# Altium schematic sheet Sunfish_ECU_MotorDriver_RevA.SchDoc
size A3; _PRJ_TITLE: PROJECT TITLE; _SHT_TITLE: Sheet; _REV: A; PageSetup: Record=PageOptions|CenterHorizontal=True|CenterVertical=True|PrintScale=0.71|XCorrection=1.00|YCorrection=1.00|PrintKind=0|BorderSize=5000000|LeftOffset=0|BottomOffset=0|Orientation=2|PaperLength=1000|PaperWidth=1000|Scale=100|PaperSource=258|PrintQuality=600|MediaType=1|DitherType=10|PaperKind=A3 (297x420mm)|PrintScaleMode=1
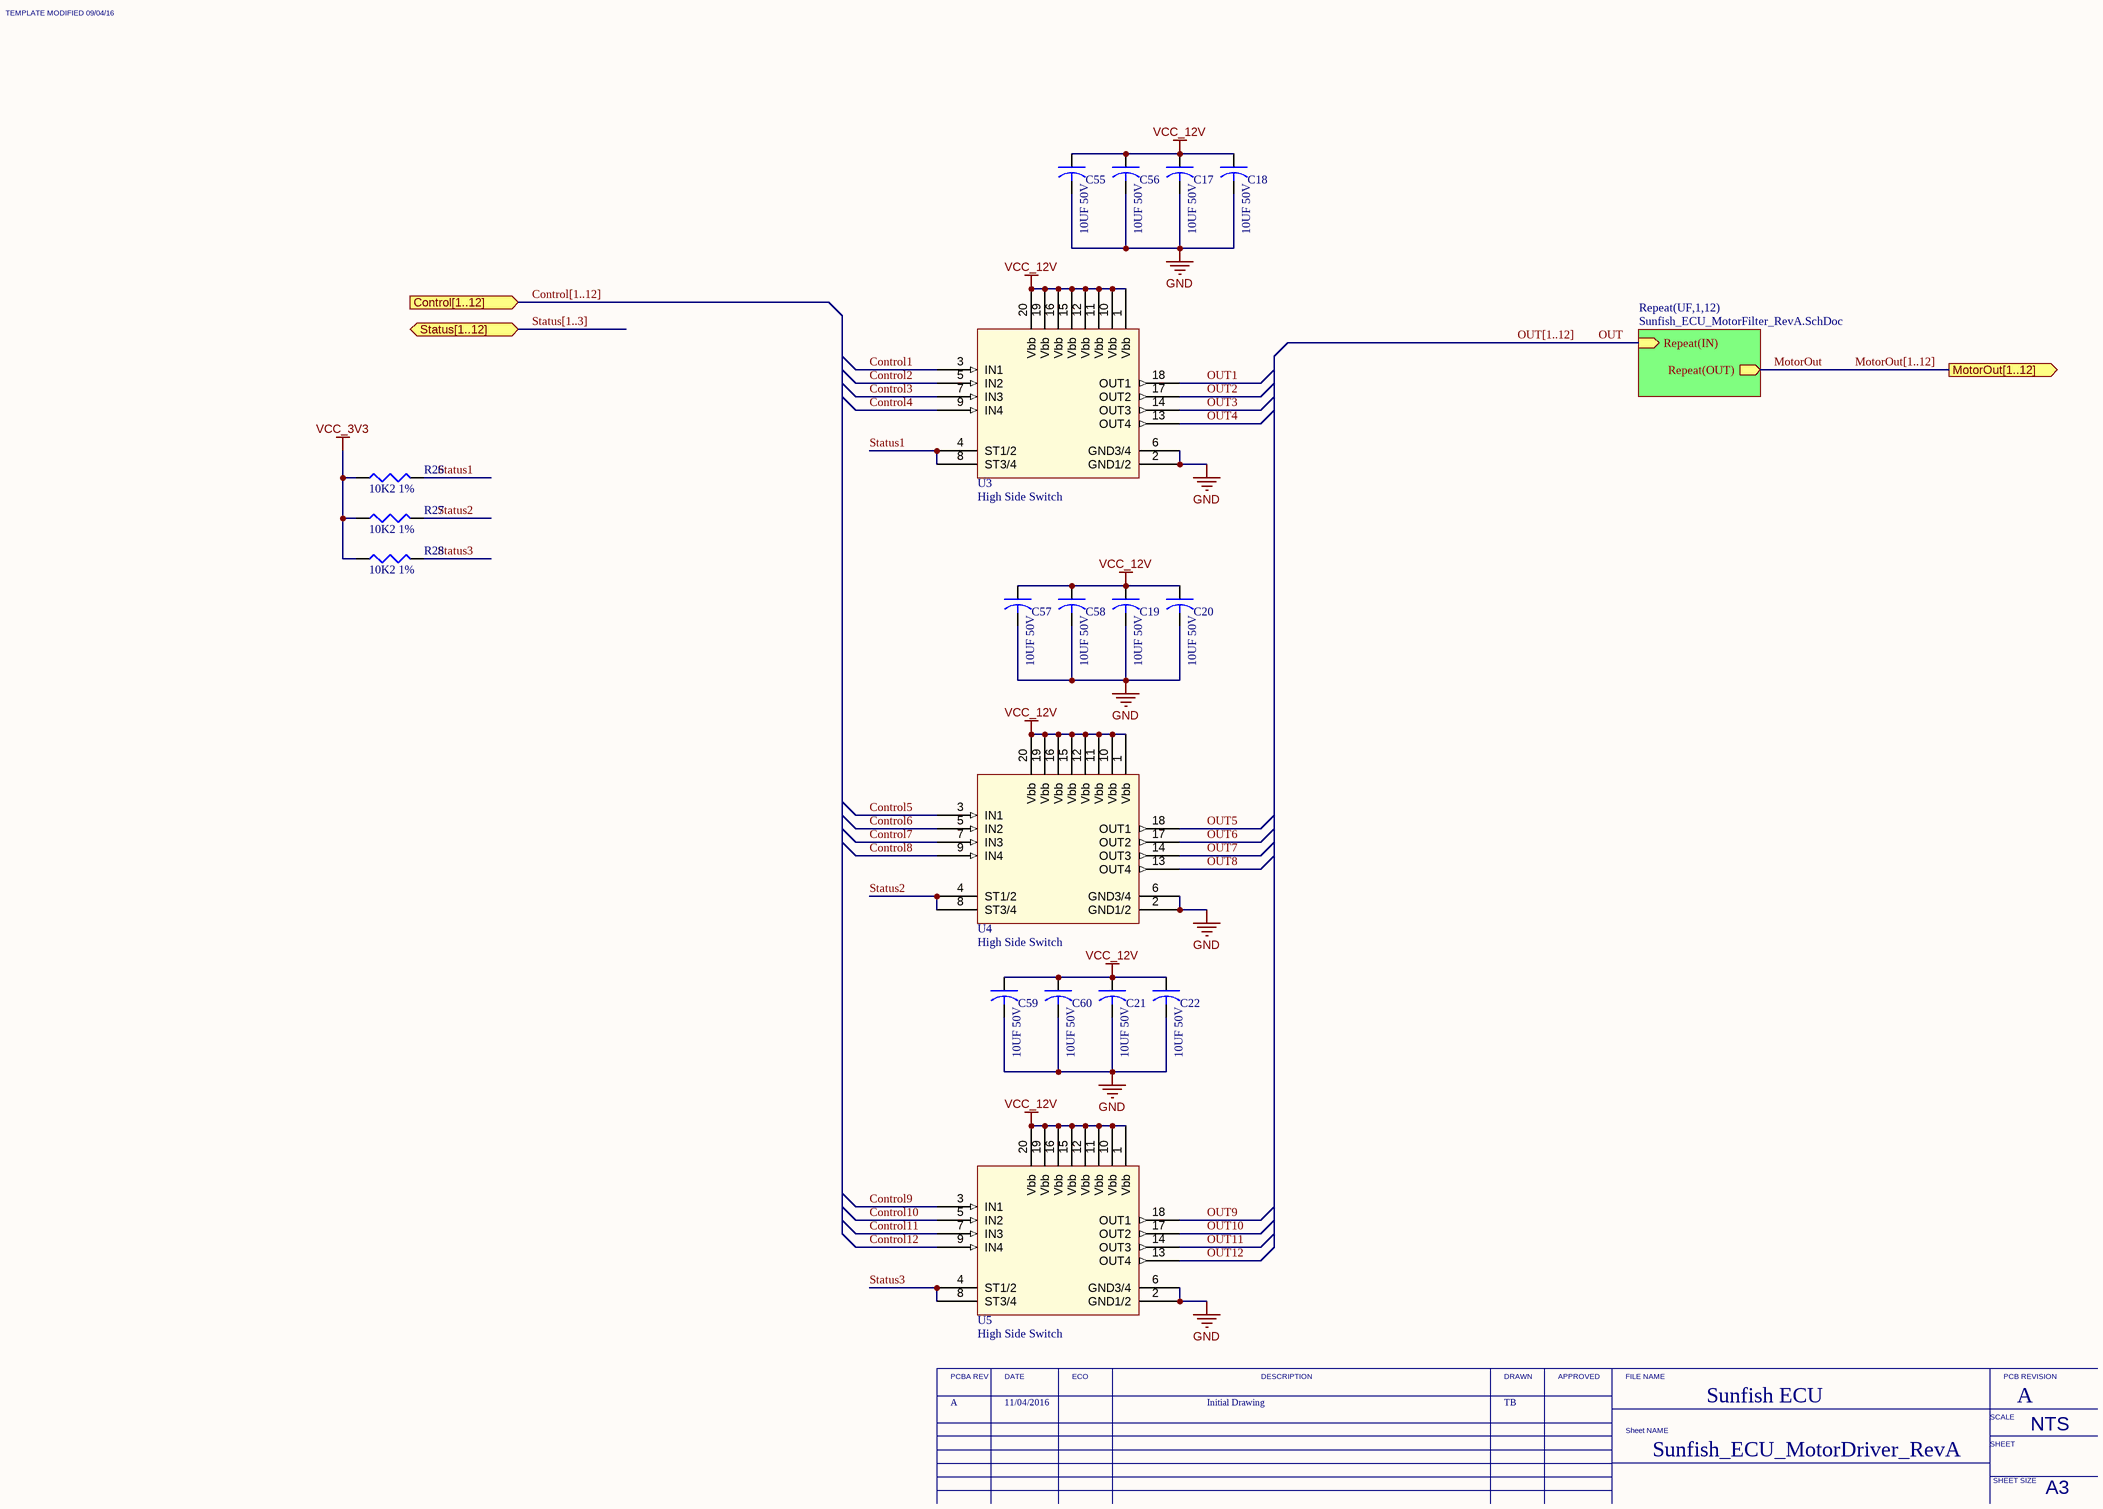
[diagram p0: Sunfish_ECU_MotorDriver_RevA.SchDoc]

## Parts
C17  10UF 50V  [1206]
C18  10UF 50V  [1206]
C19  10UF 50V  [1206]
C20  10UF 50V  [1206]
C21  10UF 50V  [1206]
C22  10UF 50V  [1206]
C55  10UF 50V  [1206]
C56  10UF 50V  [1206]
C57  10UF 50V  [1206]
C58  10UF 50V  [1206]
C59  10UF 50V  [1206]
C60  10UF 50V  [1206]
R26  10K2 1%  [0603]
R27  10K2 1%  [0603]
R28  10K2 1%  [0603]
U3  High Side Switch  [SOIC127P1030X265-20M]
U4  High Side Switch  [SOIC127P1030X265-20M]
U5  High Side Switch  [SOIC127P1030X265-20M]

## Sub-sheets
Repeat(UF,1,12) = Sunfish_ECU_MotorFilter_RevA.SchDoc: Repeat(IN) (in), Repeat(OUT) (out)

## Ports
Control[1..12] (in), MotorOut[1..12] (out), Status[1..12] (bidir)

## Nets
GND: C17.2 C18.2 C19.2 C20.2 C21.2 C22.2 C55.2 C56.2 C57.2 C58.2 C59.2 C60.2 U3.2(GND1/2) U3.6(GND3/4) U4.2(GND1/2) U4.6(GND3/4) U5.2(GND1/2) U5.6(GND3/4)
VCC_3V3: R26.1 R27.1 R28.1
VCC_12V: C17.1 C18.1 C19.1 C20.1 C21.1 C22.1 C55.1 C56.1 C57.1 C58.1 C59.1 C60.1 U3.1(Vbb) U3.10(Vbb) U3.11(Vbb) U3.12(Vbb) U3.15(Vbb) U3.16(Vbb) U3.19(Vbb) U3.20(Vbb) U4.1(Vbb) U4.10(Vbb) U4.11(Vbb) U4.12(Vbb) U4.15(Vbb) U4.16(Vbb) U4.19(Vbb) U4.20(Vbb) U5.1(Vbb) U5.10(Vbb) U5.11(Vbb) U5.12(Vbb) U5.15(Vbb) U5.16(Vbb) U5.19(Vbb) U5.20(Vbb)
Control1: U3.3(IN1)
Control2: U3.5(IN2)
Control3: U3.7(IN3)
Control4: U3.9(IN4)
Control5: U4.3(IN1)
Control6: U4.5(IN2)
Control7: U4.7(IN3)
Control8: U4.9(IN4)
Control9: U5.3(IN1)
Control10: U5.5(IN2)
Control11: U5.7(IN3)
Control12: U5.9(IN4)
MotorOut: sheet Repeat(UF,1,12)/Repeat(OUT)
OUT: sheet Repeat(UF,1,12)/Repeat(IN)
OUT1: U3.18(OUT1)
OUT2: U3.17(OUT2)
OUT3: U3.14(OUT3)
OUT4: U3.13(OUT4)
OUT5: U4.18(OUT1)
OUT6: U4.17(OUT2)
OUT7: U4.14(OUT3)
OUT8: U4.13(OUT4)
OUT9: U5.18(OUT1)
OUT10: U5.17(OUT2)
OUT11: U5.14(OUT3)
OUT12: U5.13(OUT4)
Status1: R26.2 U3.4(ST1/2) U3.8(ST3/4)
Status2: R27.2 U4.4(ST1/2) U4.8(ST3/4)
Status3: R28.2 U5.4(ST1/2) U5.8(ST3/4)

## Buses and harness runs
bus Control[1..12] = port Control[1..12]
bus MotorOut[1..12] = port MotorOut[1..12]
bus OUT[1..12]
bus Status[1..3] = port Status[1..12]

## Notes on the sheet
- A
- 11/04/2016
- Initial Drawing
- TB
- Sunfish_ECU_MotorDriver_RevA
- Sunfish ECU
- TEMPLATE MODIFIED 09/04/16
- PCBA REV
- DATE
- ECO
- DESCRIPTION
- DRAWN
- APPROVED
- FILE NAME
- PCB REVISION
- Sheet NAME
- SCALE
- SHEET
- NTS
- SHEET SIZE
- A3

## Library data of the parts
C17-C22 C55-C60 = CAP_10UF_50V_10%_1206: CAP CER 10UF 50V 10% X5R 1206; Manufacturer: Murata; Manufacturer P/N: GRM31CR61H106KA12L
R26-R28 = RES_10K2_1%_0603: Resistor, 10K2, 1%, 0603; Manufacturer: Yageo; Manufacturer P/N: RC0603FR-0710K2L
U3-U5 = IC_HSS_BTS724G: IC HISIDE PWR SWITCH 4CH PDSO-20; Manufacturer: Infineon; Manufacturer P/N: BTS724GXUMA1